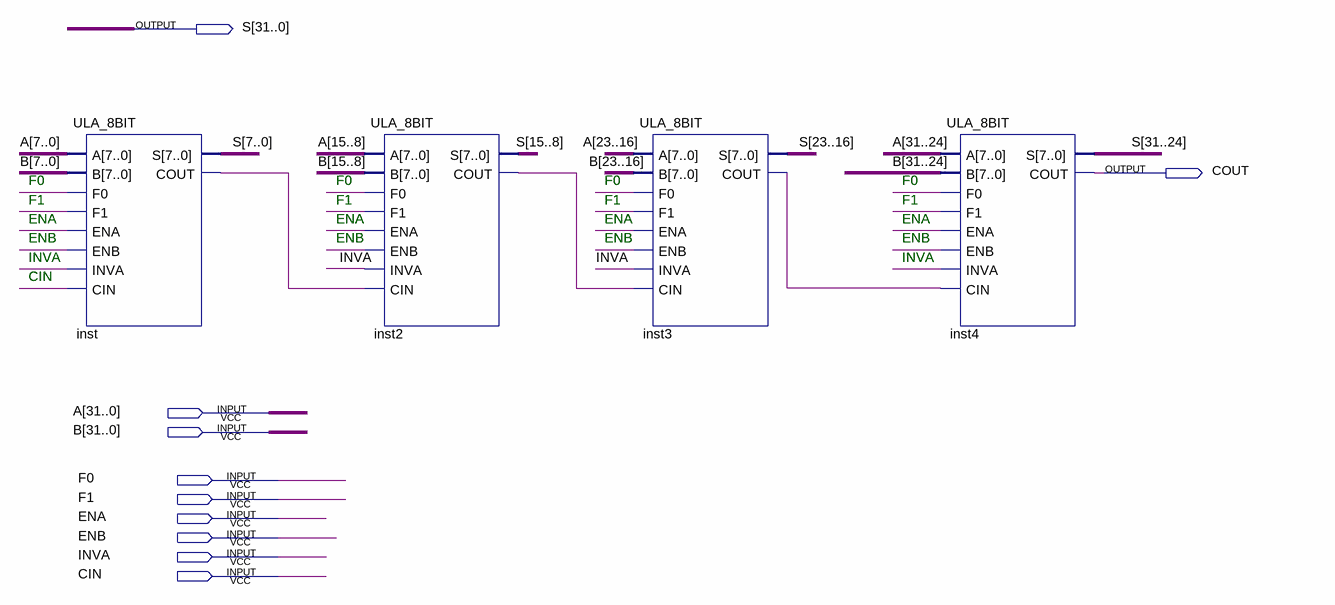
[diagram p0: schematic sheet]
// Quartus schematic ULA_32BIT.bdf as structural Verilog: 4 symbols, 10 pins
module ULA_32BIT (
  input  [31:0] A,
  input  [31:0] B,
  input  F0,
  input  F1,
  input  ENA,
  input  ENB,
  input  INVA,
  input  CIN,
  output [31:0] S,
  output COUT
);

  wire inst2_cout, inst3_cout, inst_cout;

  ULA_8BIT inst (
    .A(A[7:0]), .B(B[7:0]), .F0(F0), .F1(F1), .ENA(ENA), .ENB(ENB), .INVA(INVA), .CIN(CIN), .S(S[7:0]),
    .COUT(inst_cout));
  ULA_8BIT inst2 (
    .A(A[15:8]), .B(B[15:8]), .F0(F0), .F1(F1), .ENA(ENA), .ENB(ENB), .INVA(INVA), .CIN(inst_cout),
    .S(S[15:8]), .COUT(inst2_cout));
  ULA_8BIT inst3 (
    .A(A[23:16]), .B(B[23:16]), .F0(F0), .F1(F1), .ENA(ENA), .ENB(ENB), .INVA(INVA), .CIN(inst2_cout),
    .S(S[23:16]), .COUT(inst3_cout));
  ULA_8BIT inst4 (
    .A(A[31:24]), .B(B[31:24]), .F0(F0), .F1(F1), .ENA(ENA), .ENB(ENB), .INVA(INVA), .CIN(inst3_cout),
    .S(S[31:24]), .COUT(COUT));

  // Notes on the sheet:
  //   F0
  //   F0
  //   F0
  //   F0
  //   F0
  //   F0
  //   F1
  //   F1
  //   F1
  //   F1
  //   F1
  //   F1
  //   ENA
  //   ENA
  //   ENA
  //   ENA
  //   ENA
  //   ENA
  //   ENB
  //   ENB
  //   ENB
  //   ENB
  //   ENB
  //   ENB
  //   INVA
  //   INVA
  //   CIN
endmodule
